# EAGLE design Blinky (EAGLE 8.6.0)
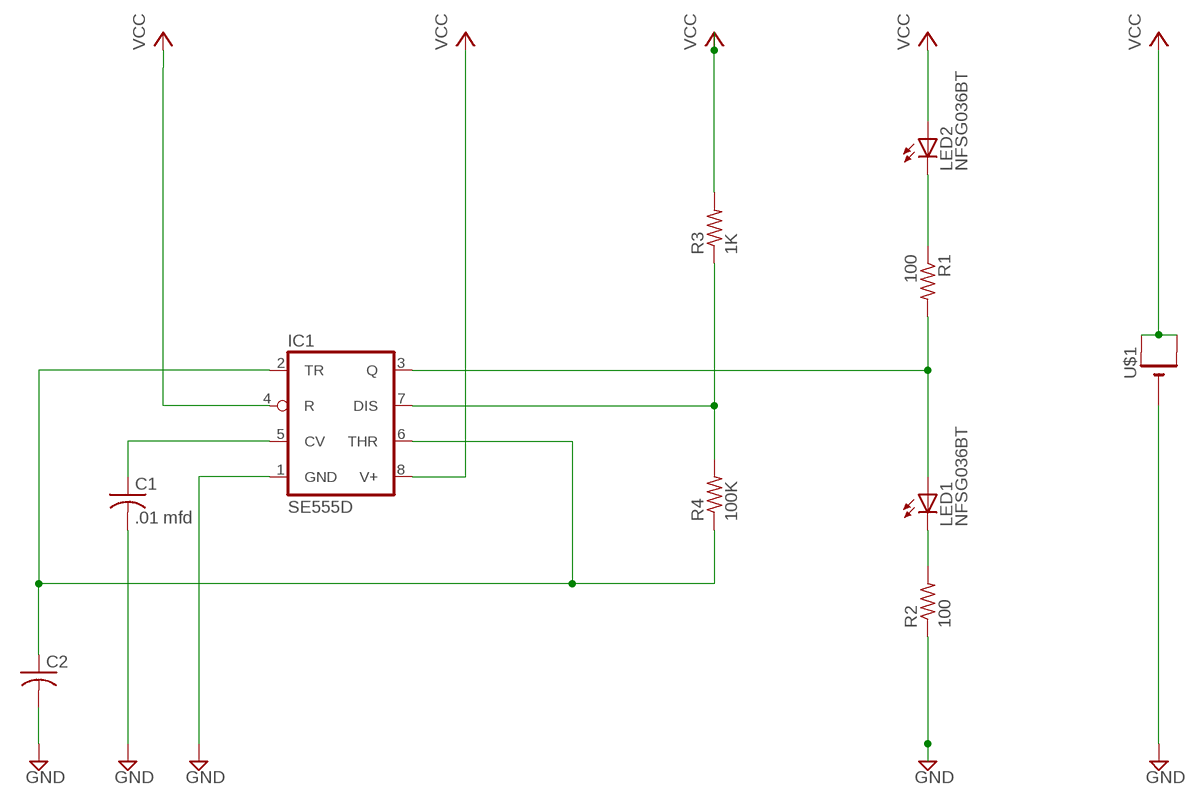
[diagram p0: schematic, sheet 1]

## Parts
C1  .01 mfd  C-USC0805  [C0805]
C2  C-USC0805  [C0805]
IC1  SE555D  [SO08]
LED1  NFSG036BT  [NFSG036BT]
LED2  NFSG036BT  [NFSG036BT]
R1  100  R-US_M0805  [M0805]
R2  100  R-US_M0805  [M0805]
R3  1K  R-US_M0805  [M0805]
R4  100K  R-US_M0805  [M0805]
U$1  CR1220THM  [CR1220-THM]

## Nets
GND: C1.2 C2.2 IC1.1(GND) R2.1 U$1.-
N$1: C1.1 IC1.5(CV)
N$2: LED2.C R1.1
N$3: IC1.3(Q) LED1.A R1.2
N$4: LED1.C R2.2
N$5: IC1.7(DIS) R3.1 R4.2
N$7: C2.1 IC1.2(TR) IC1.6(THR) R4.1
VCC: IC1.4(R) IC1.8(V+) LED2.A R3.2 U$1.+1(+) U$1.+2(+1)

## Library data of the parts
C1 C2 = adafruit:C-US: CAPACITOR, American symbol
IC1 = linear:*555: TIMER
LED1 LED2 = led:NFSG036BT: CHIP TYPE GREEN LED NFSx036xT Source: NICHIA CORPORATION .. NFSG036BT-E.pdf
R1-R4 = resistor:R-US_: RESISTOR, American symbol
U$1 = adafruit:CR1220: CR1216/CR1220/CR1225 12mm 3V lithium coin cell Great for battery packup. Both SMT and THM holders. Note the THM package has the ground pads on both sides of the PCB so that the masks are the same - this reduces the cost

## Board
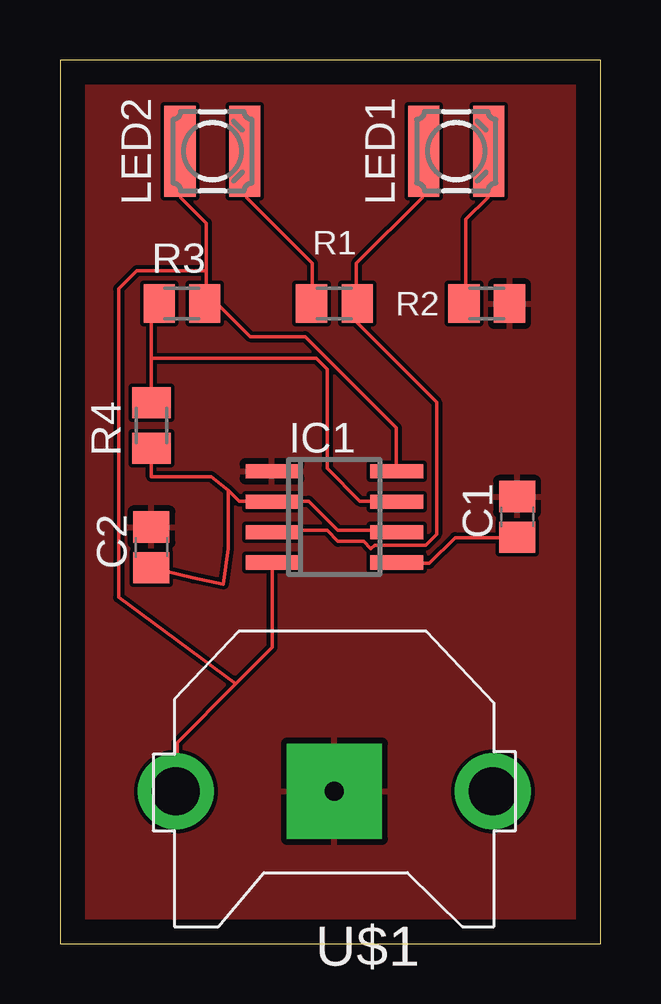
[diagram p1: board, top side]
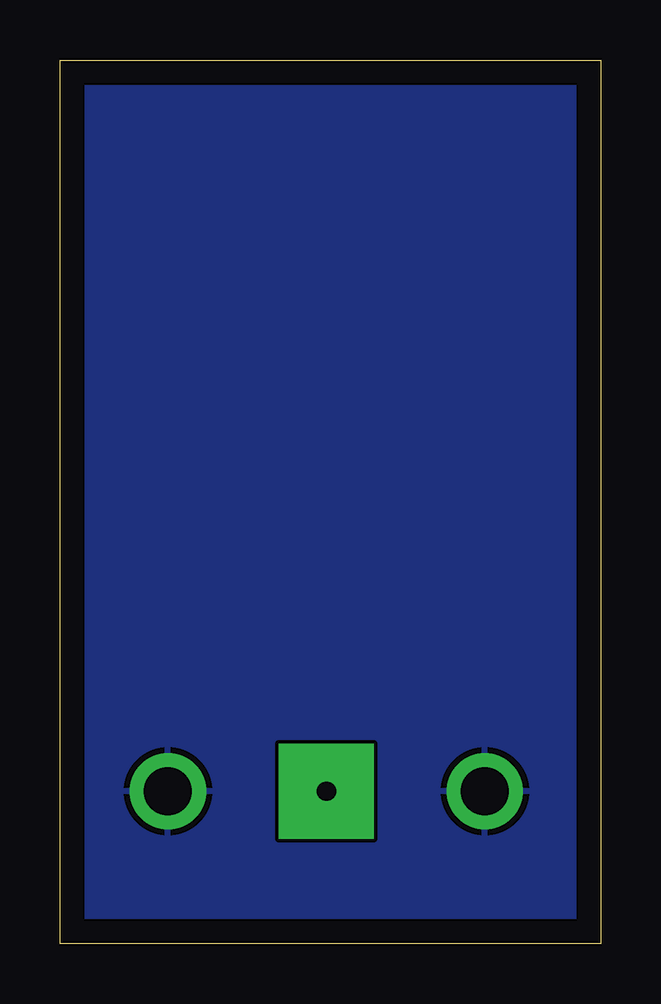
[diagram p2: board, bottom side, seen from below]

Size 22.53 x 36.82 mm. Coordinates in mm from the lower left corner, seen from the top.
Outline: 0,0 22.53,0 22.53,36.82 0,36.82 0,0
Copper layers (1*16): Top 0.035mm / dielectric 1.5mm / Bottom 0.035mm
Design rules "default": minimum track width 6mil, minimum drill 0.35mm, track to track 6mil, track to pad 6mil, pad to pad 6mil, via to via 6mil, smd to smd 6mil, copper to edge 40mil, drill to drill 6mil, minimum pad ring 10mil, minimum via ring 8mil, stop-mask expansion 4mil, vias tented up to drill 0mil, thermal gap 10mil

### Footprints (pad centres in the part's own frame; a part is rotated, then mirrored left to right if it is on the bottom)
C0805 = smd 1.3 x 1.5: 1 -0.85,0; 2 0.85,0
SO08 = smd 0.6 x 2.2: 1 -1.905,-2.6; 2 -0.635,-2.6; 3 0.635,-2.6; 4 1.905,-2.6; 5 1.905,2.6; 6 0.635,2.6; 7 -0.635,2.6; 8 -1.905,2.6
NFSG036BT = smd 1.3 x 3.8: A 1.35,0; C -1.35,0
M0805 = smd 1.3 x 1.6: 1 -0.95,0; 2 0.95,0
CR1220-THM = drill 2 pad 3.175: +1 -6.604,0; +2 6.604,0 | drill 0.8 pad 3.962 square: - 0,0

### Placement (x,y rotation side)
C1  19.05,17.78 90 top
C2  3.81,16.51 90 top
IC1  11.43,17.78 270 top
LED1  16.51,33.02 180 top
LED2  6.35,33.02 180 top
R1  11.43,26.67 0 top
R2  17.78,26.67 180 top
R3  5.08,26.67 0 top
R4  3.81,21.59 90 top
U$1  11.43,6.35 180 top

### Tracks (layer width: path | path; a pad name or v marks a point on that pad's centre or on a via)
GND
  pour Top: -1.27,44.45 -1.27,-1.27 39.37,-1.27 39.37,44.45
N$1
  Top 0.152: C1.1 19.05,16.92 16.46,16.92 15.39,15.85 14.17,15.85 IC1.5
N$2
  Top 0.152: R1.1 10.52,26.67 10.52,28.35 7.77,31.09 7.77,32.92 LED2.C
N$3
  Top 0.152: 12.34,26.67 12.34,28.35 15.09,31.09 15.09,32.92 LED1.A | 12.34,26.67 12.34,25.91 15.7,22.55 15.7,17.07 15.24,16.61 13.11,16.61 12.95,16.46 12.65,16.76 11.58,16.76 11.12,17.22 8.84,17.22 IC1.3 | 12.34,26.67 R1.2
N$4
  Top 0.152: R2.2 16.92,26.67 16.92,30.18 17.83,31.09 17.83,32.92 LED1.C
N$5
  Top 0.152: 3.81,24.38 3.81,26.36 4.12,26.67 R3.1 | 3.81,24.38 R4.2 | 3.81,24.38 10.67,24.38 11.12,23.93 11.12,19.81 12.5,18.44 14.02,18.44 IC1.7
N$7
  Top 0.152: 7.01,18.9 7.01,16.46 6.81,14.99 5.54,15.24 C2.1 | 7.01,18.9 7.47,18.44 8.69,18.44 IC1.2 8.84,18.44 10.36,18.44 11.58,17.22 14.02,17.22 IC1.6 | 7.01,18.9 6.3,19.46 3.81,19.46 R4.1
VCC
  Top 0.152: 7.32,10.82 4.88,8.38 4.88,6.4 U$1.+2 | 7.32,10.82 8.84,12.34 8.84,15.85 IC1.4 | 6.1,28.04 6.1,30.02 5.03,31.09 5.03,32.92 LED2.A | 6.1,28.04 6.1,26.67 | 6.1,26.67 6.55,26.67 7.92,25.3 10.21,25.3 14.02,21.49 14.02,19.81 IC1.8 | 6.1,26.67 R3.2 | 7.32,10.82 2.44,14.43 2.44,27.28 3.2,28.04 6.1,28.04
  pour Bottom: -1.27,43.18 -1.27,-1.27 39.37,-1.27 39.37,44.45 -1.27,44.45